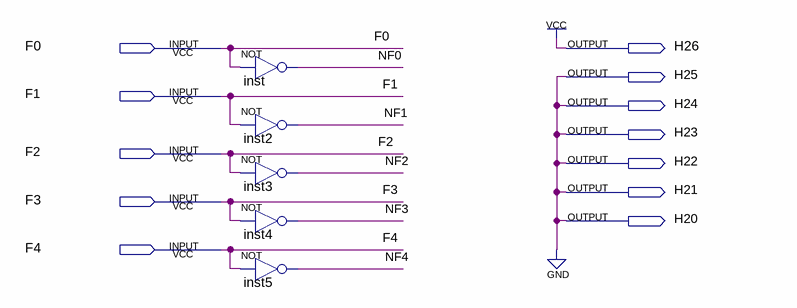
[diagram p0: schematic sheet]
// Quartus schematic DecodificadorHEX2.bdf as structural Verilog: 5 symbols, 12 pins
module DecodificadorHEX2 (
  input  F0,
  input  F1,
  input  F2,
  input  F3,
  input  F4,
  output H26,
  output H25,
  output H24,
  output H23,
  output H22,
  output H21,
  output H20
);

  wire NF0, NF1, NF2, NF3, NF4;

  not inst (NF0, F0);
  not inst2 (NF1, F1);
  not inst3 (NF2, F2);
  not inst4 (NF3, F3);
  not inst5 (NF4, F4);

  assign H20 = 1'b0;
  assign H21 = 1'b0;
  assign H22 = 1'b0;
  assign H23 = 1'b0;
  assign H24 = 1'b0;
  assign H25 = 1'b0;
  assign H26 = 1'b1;
endmodule
